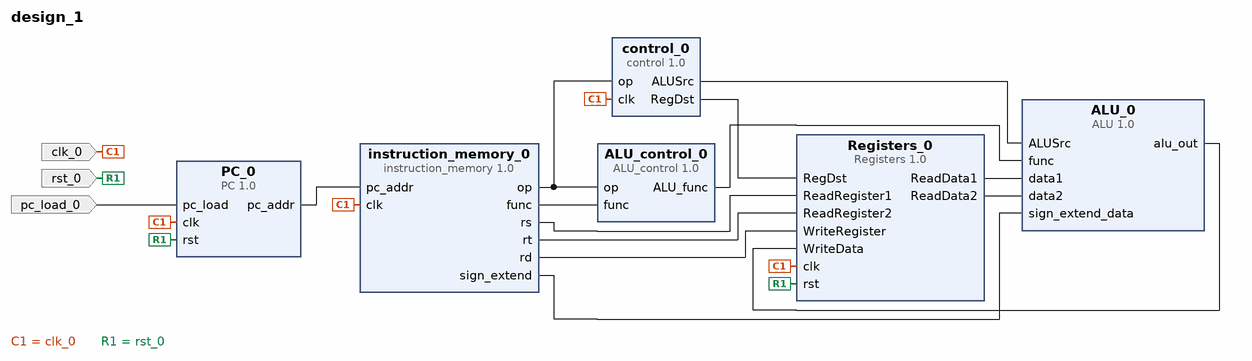
[diagram p0: block diagram of the top level]
# Vivado block design design_1, xc7a35tftg256-1, Vivado 2018.3
create_bd_design design_1

create_bd_port -dir I pc_load_0
create_bd_port -dir I -type clk clk_0
create_bd_port -dir I -type rst rst_0

create_bd_cell -type ip -vlnv xilinx.com:user:ALU_control:1.0 ALU_control_0
create_bd_cell -type ip -vlnv xilinx.com:user:control:1.0 control_0
create_bd_cell -type ip -vlnv xilinx.com:user:ALU:1.0 ALU_0
create_bd_cell -type ip -vlnv xilinx.com:user:Registers:1.0 Registers_0
create_bd_cell -type ip -vlnv xilinx.com:user:instruction_memory:1.0 instruction_memory_0
create_bd_cell -type ip -vlnv xilinx.com:user:PC:1.0 PC_0

# ---- connections ----

connect_bd_net [get_bd_pins instruction_memory_0/op] [get_bd_pins control_0/op] [get_bd_pins ALU_control_0/op]
connect_bd_net [get_bd_pins instruction_memory_0/rs] [get_bd_pins Registers_0/ReadRegister1]
connect_bd_net [get_bd_pins instruction_memory_0/rt] [get_bd_pins Registers_0/ReadRegister2]
connect_bd_net [get_bd_pins instruction_memory_0/rd] [get_bd_pins Registers_0/WriteRegister]
connect_bd_net [get_bd_pins ALU_control_0/ALU_func] [get_bd_pins ALU_0/func]
connect_bd_net [get_bd_pins control_0/ALUSrc] [get_bd_pins ALU_0/ALUSrc]
connect_bd_net [get_bd_pins control_0/RegDst] [get_bd_pins Registers_0/RegDst]
connect_bd_net [get_bd_pins ALU_0/alu_out] [get_bd_pins Registers_0/WriteData]
connect_bd_net [get_bd_pins Registers_0/ReadData1] [get_bd_pins ALU_0/data1]
connect_bd_net [get_bd_pins Registers_0/ReadData2] [get_bd_pins ALU_0/data2]
connect_bd_net [get_bd_pins PC_0/pc_addr] [get_bd_pins instruction_memory_0/pc_addr]
connect_bd_net -net pc_load_0_1 [get_bd_ports pc_load_0] [get_bd_pins PC_0/pc_load]
connect_bd_net -net clk_0_1 [get_bd_ports clk_0] \
  [get_bd_pins PC_0/clk] [get_bd_pins instruction_memory_0/clk] [get_bd_pins Registers_0/clk] [get_bd_pins control_0/clk]
connect_bd_net -net rst_0_1 [get_bd_ports rst_0] [get_bd_pins PC_0/rst] [get_bd_pins Registers_0/rst]
connect_bd_net [get_bd_pins instruction_memory_0/sign_extend] [get_bd_pins ALU_0/sign_extend_data]
connect_bd_net [get_bd_pins instruction_memory_0/func] [get_bd_pins ALU_control_0/func]

validate_bd_design
save_bd_design
